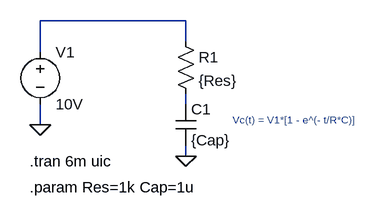
[diagram p0: schematic AnaliseTRAN_UIC.asc]
AnaliseTRAN_UIC.asc, the LTspice schematic file:
Version 4
SHEET 1 880 680
WIRE 256 32 32 32
WIRE 256 64 256 32
WIRE 32 80 32 32
WIRE 256 160 256 144
WIRE 32 192 32 160
WIRE 256 240 256 224
FLAG 32 192 0
FLAG 256 240 0
SYMBOL voltage 32 64 R0
WINDOW 123 0 0 Left 0
WINDOW 39 0 0 Left 0
SYMATTR InstName V1
SYMATTR Value 10V
SYMBOL res 240 48 R0
SYMATTR InstName R1
SYMATTR Value {Res}
SYMBOL cap 240 160 R0
SYMATTR InstName C1
SYMATTR Value {Cap}
TEXT 16 248 Left 2 !.tran 6m uic
TEXT 328 184 Left 1 ;Vc(t) = V1*[1 - e^(- t/R*C)]
TEXT 16 288 Left 2 !.param Res=1k Cap=1u

The netlist it stands for:
* AnaliseTRAN_UIC.asc
V1 N001 0 10V
R1 N001 N002 {Res}
C1 N002 0 {Cap}
.tran 6m uic
* Vc(t) = V1*[1 - e^(- t/R*C)]
.param Res=1k Cap=1u
.backanno
.end